# EAGLE schematic power_board_pcie - v2 (EAGLE 9.1.3)
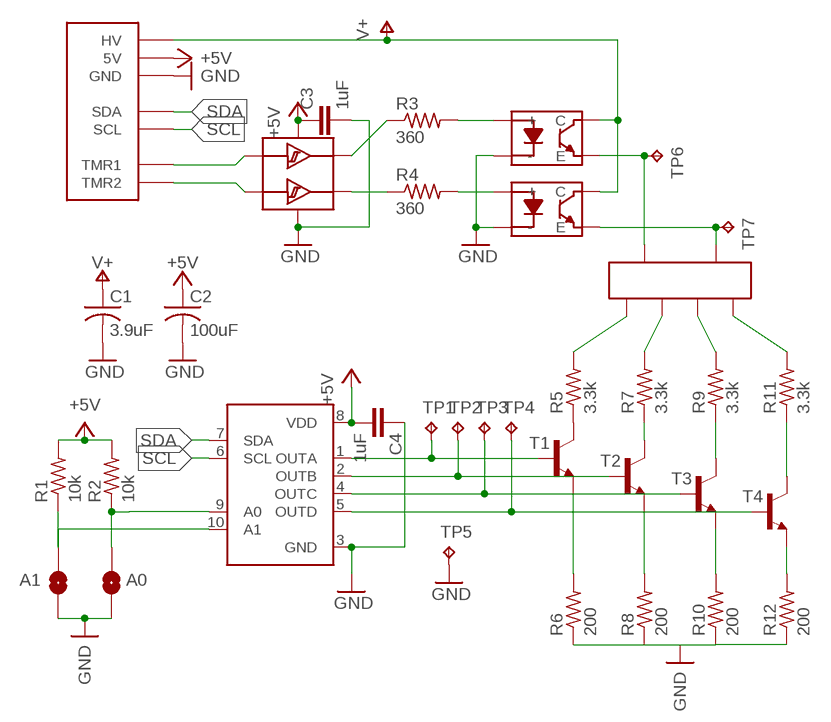
[diagram p0: schematic, sheet 1]

## Parts
A0  JUMPER-SMT_2_NO_SILK_ROUND  [SMT-JUMPER_2_NO_SILK_ROUND]
A1  JUMPER-SMT_2_NO_SILK_ROUND  [SMT-JUMPER_2_NO_SILK_ROUND]
C1  3.9uF  UUX2D3R9MNL1GS  [CAPAE830X1030]
C2  100uF  UWR1A101MCL1GB  [CAPAE530X550]
C3  1uF  C-EUC1206  [C1206]
C4  1uF  C-EUC1206  [C1206]
J1  PCIE_EDGE  [PCIE_EDGE]
JP3  POWER_EDGE  [POWER_EDGE]
R1  10k  R-US_R1206  [R1206]
R2  10k  R-US_R1206  [R1206]
R3  360  R-US_R1206  [R1206]
R4  360  R-US_R1206  [R1206]
R5  3.3k  R-US_R2512  [R2512]
R6  200  R-US_R1206  [R1206]
R7  3.3k  R-US_R2512  [R2512]
R8  200  R-US_R1206  [R1206]
R9  3.3k  R-US_R2512  [R2512]
R10  200  R-US_R1206  [R1206]
R11  3.3k  R-US_R2512  [R2512]
R12  200  R-US_R1206  [R1206]
T1  MMBT4401LT1-NPN-SOT23-BEC  [SOT23-BEC]
T2  MMBT4401LT1-NPN-SOT23-BEC  [SOT23-BEC]
T3  MMBT4401LT1-NPN-SOT23-BEC  [SOT23-BEC]
T4  MMBT4401LT1-NPN-SOT23-BEC  [SOT23-BEC]
TP1  TPB2,54  [B2,54]
TP2  TPB2,54  [B2,54]
TP3  TPB2,54  [B2,54]
TP4  TPB2,54  [B2,54]
TP5  TPB2,54  [B2,54]
TP6  TPB2,54  [B2,54]
TP7  TPB2,54  [B2,54]
U1  TC7PZ17FU  [SOP65P210X100-6]
U2  DAC5574  [SOP50P490X110-10]
U3  LTV-352T  [SOP254P675X220-4]
U4  LTV-352T  [SOP254P675X220-4]

## Nets
+5V: C2.1 C3.1 C4.2 J1.5V1(5V) J1.5V2(5V) R1.2 R2.2 U1.5(VCC) U2.8(VDD)
GND: A0.1 A1.1 C1.2 C2.2 C3.2 C4.1 J1.GND1(GND) J1.GND2(GND) R6.1 R8.1 R10.1 R12.1 TP5.TP U1.2(GND) U2.3(GND) U3.2(-) U4.2(-)
N$3: R3.2 U3.1(+)
N$4: R4.2 U4.1(+)
N$5: R3.1 U1.6(1Y)
N$6: R4.1 U1.4(2Y)
N$7: JP3.A3(A2) JP3.A4(A2) TP7.TP U4.3(E)
N$8: JP3.A1 JP3.A2(A1) TP6.TP U3.3(E)
N$9: JP3.C1 R5.2
N$11: JP3.C2 R7.2
N$12: JP3.C3 R9.2
N$13: JP3.C4 R11.2
N$14: R5.1 T1.C
N$15: R7.1 T2.C
N$16: R9.1 T3.C
N$17: R11.1 T4.C
N$18: R6.2 T1.E
N$19: R8.2 T2.E
N$20: R10.2 T3.E
N$21: R12.2 T4.E
N$22: T1.B TP1.TP U2.1(OUTA)
N$23: T2.B TP2.TP U2.2(OUTB)
N$24: T3.B TP3.TP U2.4(OUTC)
N$25: T4.B TP4.TP U2.5(OUTD)
N$26: A0.2 R2.1 U2.9(A0)
N$27: A1.2 R1.1 U2.10(A1)
SCL: J1.SCL1(SCL) J1.SCL2(SCL) U2.6(SCL)
SDA: J1.SDA1(SDA) J1.SDA2(SDA) U2.7(SDA)
TMR1: J1.TMR1_1(TMR1) J1.TMR1_2(TMR1) U1.1(1A)
TMR2: J1.TMR2_1(TMR2) J1.TMR2_2(TMR2) U1.3(2A)
V+: C1.1 J1.HV1(HV) J1.HV2(HV) U3.4(C) U4.4(C)

## Library data of the parts
A0 A1 = SparkFun-Jumpers:JUMPER-SMT_2_NO: Normally open jumper This jumper has two pads in close proximity to each other. Apply solder to close the connection. Round pads are easier to solder for beginners, but are a lot larger. SparkFun Product that uses the round pads: SparkFun EL Sequencer <https://www.sparkfun.com/products/12781>
C1 = tide_clock:UUX2D3R9MNL1GS
C2 = tide_clock:UWR1A101MCL1GB
C3 C4 = resistor:C-EU: CAPACITOR, European symbol
J1 = tide_clock:PCIE_EDGE
JP3 = tide_clock:POWER_EDGE
R1-R12 = resistor:R-US_: RESISTOR, American symbol
T1-T4 = transistor:*-NPN-: NPN Transistror BF959 corrected 2008.03.06
TP1-TP7 = testpad:TP: Test pad
U1 = tide_clock:TC7PZ17FU
U2 = tide_clock:DAC5574
U3 U4 = tide_clock:LTV-352T